# EAGLE design board (EAGLE 7.3.0)
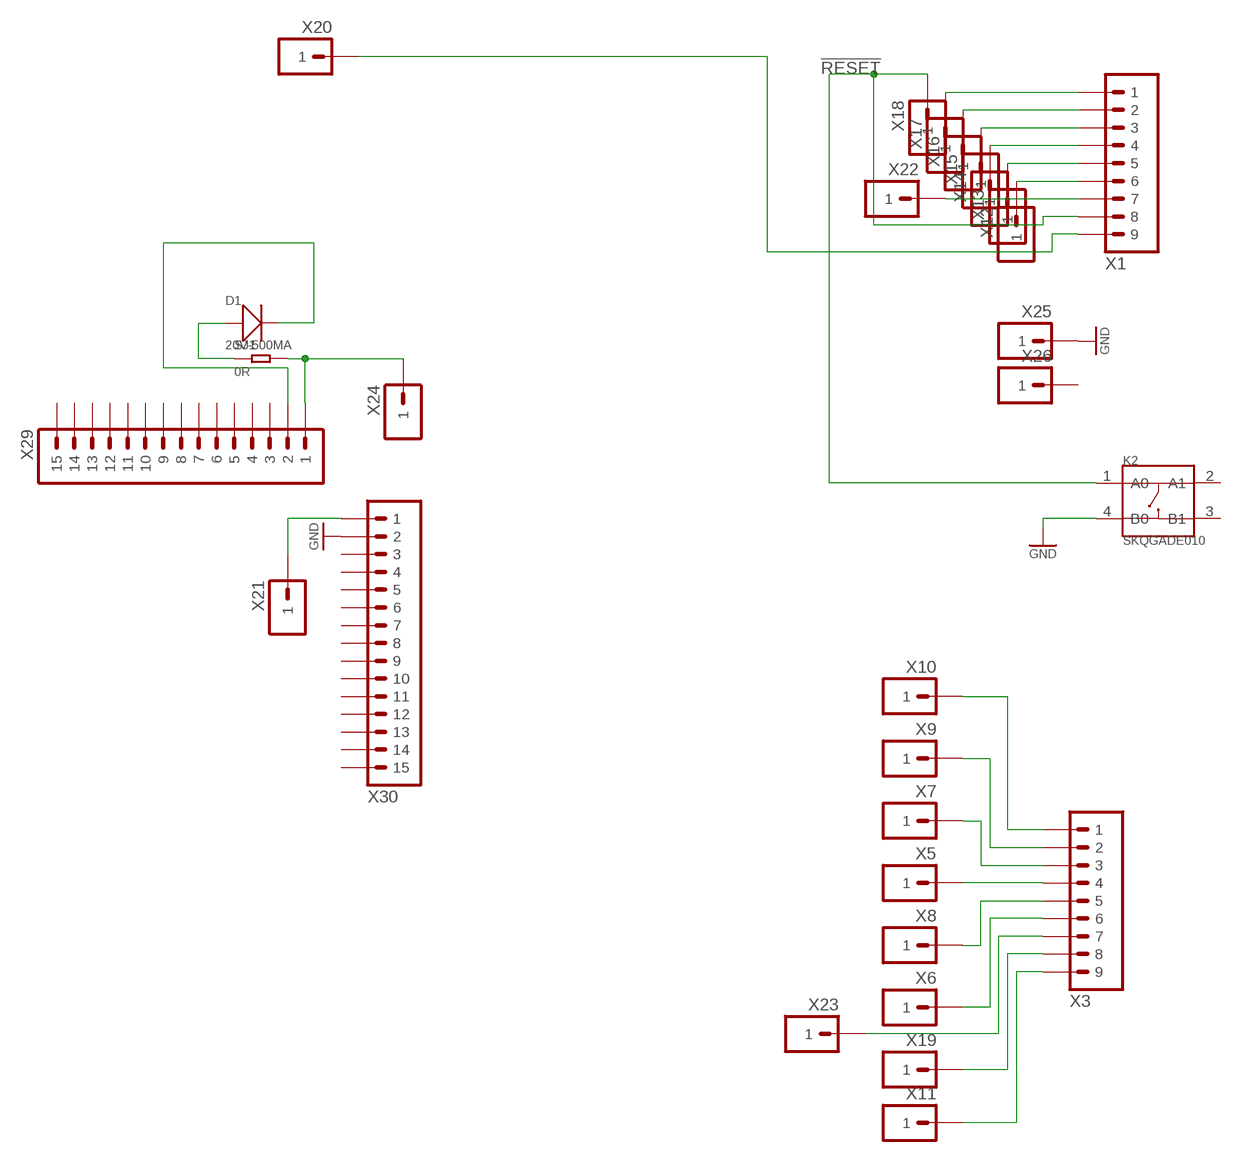
[diagram p0: schematic, sheet 1]

## Parts
D1  20V-500MA  SMD-DIODE-SCHOTTKY-20V-500MA(SOD-123)  [SOD-123]
K2  SKQGADE010  SMD-SWITCH-TOP-260GF(4P-D5.2MM)  [SW4-SMD-5.2X5.2X1.5MM]
SJ1  0R  SMD-RES-1.5K-1%-1/8W(0805)  [R0805]
X1  9P1/MIN_NOSILK  [HEADER_1X9_1/MIN_NOSILK]
X3  9P1/MIN_NOSILK  [HEADER_1X9_1/MIN_NOSILK]
X5  1P  [1P_X]
X6  1P  [1P_X]
X7  1P  [1P_X]
X8  1P  [1P_X]
X9  1P  [1P_X]
X10  1P  [1P_X]
X11  1P1/MIN_SILK2  [HEADER_1X1_1/MIN_SILK2]
X12  1P  [1P_X]
X13  1P  [1P_X]
X14  1P  [1P_X]
X15  1P  [1P_X]
X16  1P  [1P_X]
X17  1P  [1P_X]
X18  1P  [1P_X]
X19  1P1/MIN_SILK2  [HEADER_1X1_1/MIN_SILK2]
X20  1P1/MIN_SILK2  [HEADER_1X1_1/MIN_SILK2]
X21  1P1/MIN_SILK2  [HEADER_1X1_1/MIN_SILK2]
X22  1P1/MIN_SILK2  [HEADER_1X1_1/MIN_SILK2]
X23  1P1/MIN_SILK2  [HEADER_1X1_1/MIN_SILK2]
X24  1P1/MIN_SILK2  [HEADER_1X1_1/MIN_SILK2]
X25  1P  [1P_X]
X26  1P  [1P_X]
X29  15P1/MIN_NOSILK  [HEADER_1X15_1/MIN_NOSILK]
X30  15P1/MIN_NOSILK  [HEADER_1X15_1/MIN_NOSILK]

## Nets
!RESET: K2.1(A0) X1.8 X18.P$1
GND: K2.4(B0) X25.P$1 X30.2
N$1: X1.9 X20.1
N$2: X3.9 X11.1
N$3: X3.7 X23.1
N$4: SJ1.2 X24.1 X29.1
N$5: X1.1 X17.P$1
N$6: X1.2 X16.P$1
N$7: X1.3 X15.P$1
N$8: X1.4 X14.P$1
N$9: X1.5 X13.P$1
N$10: X1.6 X12.P$1
N$11: X21.1 X30.1
N$12: X3.1 X10.P$1
N$13: X3.2 X9.P$1
N$14: X3.3 X7.P$1
N$15: X3.4 X5.P$1
N$16: X3.5 X8.P$1
N$17: X3.6 X6.P$1
N$18: D1.- X29.2
N$19: D1.+ SJ1.1
N$20: X3.8 X19.1
N$21: X1.7 X22.1
Unconnected: K2.2(A1) K2.3(B1) X26.P$1 X29.3 X29.4 X29.5 X29.6 X29.7 X29.8 X29.9 X29.10 X29.11 X29.12 X29.13 X29.14 X29.15 X30.3 X30.4 X30.5 X30.6 X30.7 X30.8 X30.9 X30.10 X30.11 X30.12 X30.13 X30.14 X30.15

## Library data of the parts
D1 = Seeed-OPL-Diode:SMD-DIODE-SCHOTTKY-20V-500MA(SOD-123): 304020028; MPN: MBR0520LT1G
K2 = Seeed-OPL-Button:SMD-SWITCH-TOP-260GF(4P-D5.2MM): 311020017
SJ1 = Seeed-OPL-Resistor:SMD-RES-1.5K-1%-1/8W(0805): 301010394; MPN: RC0805FR-071K5L; VALUE: 1.5K
X1 X3 = TW_pinheader:9P
X5-X26 = TW_pinheader:1P
X29 X30 = TW_pinheader:15P

## Board
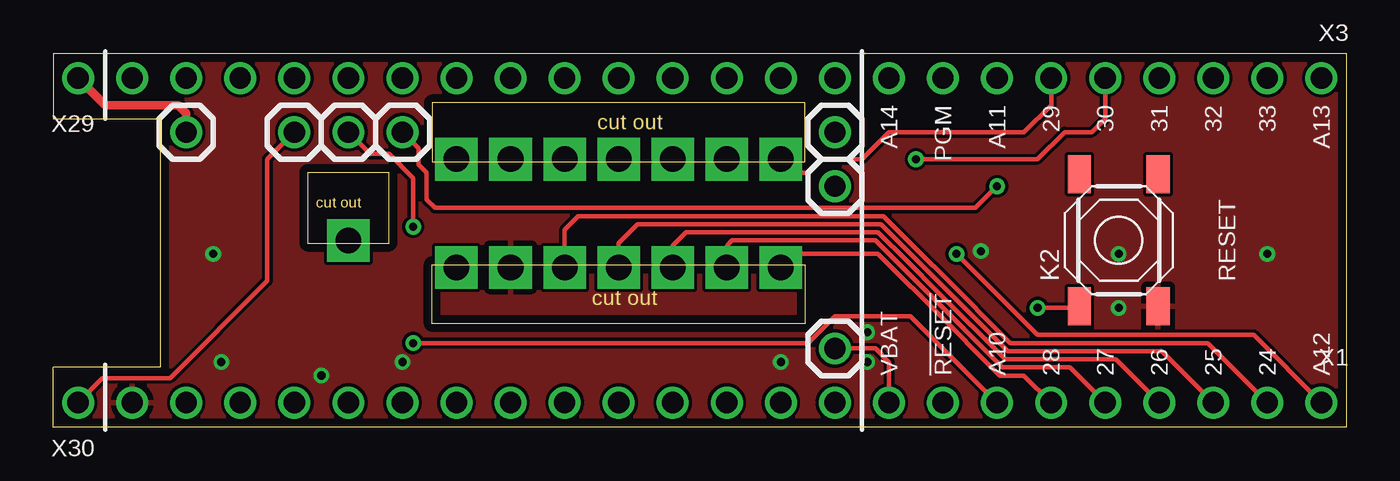
[diagram p1: board, top side]
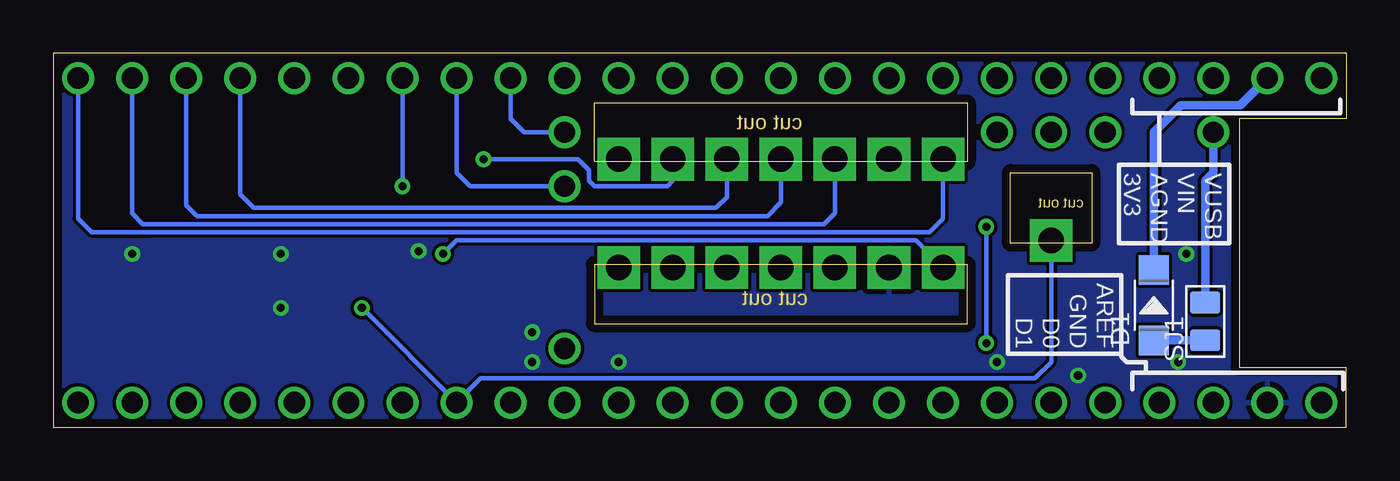
[diagram p2: board, bottom side, seen from below]

Size 60.76 x 17.58 mm. Coordinates in mm from the lower left corner, seen from the top.
Outline: 0,14.5 5.03,14.5 5.03,2.82 0,2.82 0,0 60.76,0 60.76,17.58 0,17.58 0,14.5
Outline: 17.81,12.47 35.33,12.47 35.33,15.24 17.81,15.24 17.81,12.47
Outline: 17.81,7.65 35.33,7.65 35.33,4.88 17.81,4.88 17.81,7.65
Outline: 11.96,8.66 15.77,8.66 15.77,11.96 11.96,11.96 11.96,8.66
Copper layers (1*16): Top 0.0356mm / dielectric 1.5011mm / Bottom 0.0356mm
Design rules "oshpark-2layer": minimum track width 6mil, minimum drill 13mil, track to track 6mil, track to pad 6mil, pad to pad 6mil, via to via 6mil, smd to smd 6mil, copper to edge 15mil, drill to drill 6mil, minimum pad ring 7mil, minimum via ring 7mil, stop-mask expansion 4mil, vias tented up to drill 0mil, thermal gap 10mil
tRestrict: 1 lines
bRestrict: 1 lines

### Footprints (pad centres in the part's own frame; a part is rotated, then mirrored left to right if it is on the bottom)
SOD-123 = smd 1.397 x 1.397: + -1.651,0; - 1.651,0
SW4-SMD-5.2X5.2X1.5MM = smd 1.8 x 1.1: 1 -3.1,1.85; 2 3.1,1.85; 3 3.1,-1.85; 4 -3.1,-1.85
R0805 = smd 1.397 x 1.016: 1 0,0.889; 2 0,-0.889
HEADER_1X9_1/MIN_NOSILK = drill 1: 1 -10.16,0; 2 -7.62,0; 3 -5.08,0; 4 -2.54,0; 5 0,0; 6 2.54,0; 7 5.08,0; 8 7.62,0; 9 10.16,0
1P_X = drill 1.2 pad 2 square: P$1 0,0
HEADER_1X1_1/MIN_SILK2 = drill 1: 1 0,0
HEADER_1X15_1/MIN_NOSILK = drill 1: 1 -17.78,0; 2 -15.24,0; 3 -12.7,0; 4 -10.16,0; 5 -7.62,0; 6 -5.08,0; 7 -2.54,0; 8 0,0; 9 2.54,0; 10 5.08,0; 11 7.62,0; 12 10.16,0; 13 12.7,0; 14 15.24,0; 15 17.78,0

### Placement (x,y rotation side)
D1  9.04,5.74 90 bottom
K2  50.06,8.79 90 top
SJ1  6.63,4.98 180 bottom
X1  49.43,1.17 180 top
X3  49.43,16.41 180 top
X5  29.11,12.6 0 top
X6  34.19,12.6 0 top
X7  26.57,12.6 0 top
X8  31.65,12.6 0 top
X9  24.03,12.6 0 top
X10  18.95,12.6 0 top
X11  36.73,13.87 90 top
X12  34.19,7.52 180 top
X13  31.65,7.52 180 top
X14  29.11,7.52 180 top
X15  26.57,7.52 180 top
X16  24.03,7.52 180 top
X17  18.95,7.52 180 top
X18  13.87,8.79 0 top
X19  36.73,11.33 90 top
X20  36.73,3.71 90 top
X21  11.33,13.87 0 top
X22  13.87,13.87 0 top
X23  16.41,13.87 0 top
X24  6.25,13.87 0 top
X25  21.49,7.52 0 top
X26  21.49,12.6 0 top
X29  18.95,16.41 0 top
X30  18.95,1.17 0 top

### Tracks (layer width: path | path; a pad name or v marks a point on that pad's centre or on a via)
!RESET  (via drill 0.38)
  Top 0.203: v46.25,5.61 48.14,5.61 K2.1
  Bottom 0.203: X18.P$1 13.87,3.07 14.63,2.31 40.67,2.31 X1.8 v46.25,5.61
GND  (via drill 0.38)
  other vias: 38.25,4.47 43.59,8.28 50.06,5.61 16.41,3.07 7.52,8.15 12.6,2.44 34.19,3.07 38.25,3.07 50.06,8.15 7.9,3.07 57.05,8.15
  pour Top: -3.91,20.85 -3.91,-4.55 73.56,-4.55 73.56,20.85
  pour Bottom: -1.37,19.58 -1.37,-1.37 72.29,-1.37 72.29,19.58
N$1
  Top 0.203: X20.1 38.63,3.71 39.27,3.07 X1.9
N$2
  Bottom 0.203: X11.1 38.63,13.87 39.27,14.5 X3.9
N$3  (via drill 0.38)
  Top 0.203: X23.1 17.04,13.23 17.17,13.11 17.17,12.34 17.55,11.96 17.55,10.69 17.93,10.31 43.33,10.31 v44.35,11.33
  Bottom 0.203: v44.35,11.33 X3.7
N$4
  Top 0.406: X29.1 2.44,15.14 5.87,15.14 6.25,14.76 X24.1
  Bottom 0.406: SJ1.2 6.63,11.58 6.25,11.96 X24.1
N$5  (via drill 0.38)
  Top 0.203: X1.1 56.41,4.34 46.25,4.34 v42.44,8.15
  Bottom 0.203: X17.P$1 20.22,8.79 41.81,8.79 v42.44,8.15
N$6
  Top 0.203: X16.P$1 24.03,9.3 24.66,9.93 39.01,9.93 40.92,8.03 41.81,7.14 44.98,3.96 54.25,3.96 X1.2
N$7
  Top 0.203: X15.P$1 26.57,8.66 27.46,9.55 38.89,9.55 40.54,7.9 41.68,6.76 44.86,3.58 52.1,3.58 X1.3
N$8
  Top 0.203: X14.P$1 29.11,8.53 29.74,9.17 38.76,9.17 40.16,7.77 41.55,6.38 44.73,3.2 49.94,3.2 X1.4
N$9
  Top 0.203: X13.P$1 31.65,8.53 31.9,8.79 38.63,8.79 39.78,7.65 41.43,5.99 44.6,2.82 47.78,2.82 X1.5
N$10
  Top 0.203: X12.P$1 34.82,8.15 38.76,8.15 39.4,7.52 41.3,5.61 44.48,2.44 45.62,2.44 X1.6
N$11
  Top 0.203: X30.1 2.31,2.31 5.49,2.31 10.06,6.88 10.06,12.6 X21.1
N$12
  Bottom 0.203: X10.P$1 18.95,9.8 19.58,9.17 38.76,9.17 56.16,9.17 58.95,9.17 59.59,9.8 X3.1
N$13
  Bottom 0.203: X9.P$1 24.03,10.06 24.54,9.55 38.89,9.55 54,9.55 56.54,9.55 57.05,10.06 X3.2
N$14
  Bottom 0.203: X7.P$1 26.57,10.57 27.2,9.93 39.01,9.93 51.21,9.93 54,9.93 54.51,10.44 X3.3
N$15
  Bottom 0.203: X5.P$1 29.11,10.82 29.62,10.31 35.97,10.31 49.05,10.31 51.33,10.31 51.97,10.95 X3.4
N$16  (via drill 0.38)
  Top 0.203: v40.54,12.6 46.25,12.6 47.52,13.87 48.79,13.87 49.43,14.5 X3.5
  Bottom 0.203: X8.P$1 31.65,11.58 31.9,11.33 35.33,11.33 35.59,11.58 35.59,12.09 36.09,12.6 39.27,12.6 v40.54,12.6
N$17
  Top 0.203: X6.P$1 34.82,11.96 35.46,11.96 36.09,12.6 38,12.6 39.27,13.87 43.71,13.87 45.62,13.87 46.89,15.14 X3.6
N$18
  Bottom 0.406: X29.2 4.98,15.14 7.77,15.14 9.04,13.87 D1.-
N$19
  Bottom 0.406: SJ1.1 D1.+
N$20
  Bottom 0.203: X3.8 41.81,11.96 41.17,11.33 X19.1
N$21  (via drill 0.38)
  Top 0.203: X22.1 14.88,12.85 15.77,12.85 16.92,11.71 v16.92,9.42 | X1.7 40.28,5.23 36.73,5.23 35.46,3.96 v16.92,3.96
  Bottom 0.203: v16.92,9.42 v16.92,3.96

### Text on the board
Dimension: cut out | cut out | cut out
bPlace: VUSB | VIN | AGND | 3V3 | AREF | GND | D0 | D1
_tsilk: A14 | PGM | A11 | 29 | 30 | 31 | 32 | 33 | A13 | RESET | VBAT | !RESET | A10 | 28 | 27 | 26 | 25 | 24 | A12